# Altium schematic sheet ClockGen.SchDoc: Наименование
size 420 x 297 mm; ApprovedBy: Утвердил; CheckedBy: Проверил; Author: Разработал; CompanyName: Организация; DrawnBy: Н.Контр; Engineer: Т.Контр; SheetNumber: 1; SheetTotal: 1; PageSetup: Record=PageOptions|CenterHorizontal=True|CenterVertical=True|PrintScale=0.94|XCorrection=1.00|YCorrection=1.00|PrintKind=1|BorderSize=5000000|LeftOffset=0|BottomOffset=0|Orientation=1|PaperLength=1000|PaperWidth=1000|Scale=100|PaperSource=7|PrintQuality=-4|MediaType=1|DitherType=10|PaperKind=A4|PrintScaleMode=1; DecimalNumber: ClockGen; HeadOfSector: Нач. сектора; MainDevice: Перв.примен.; Name: Наименование; DocumentName: Sheet1.SCHDOC
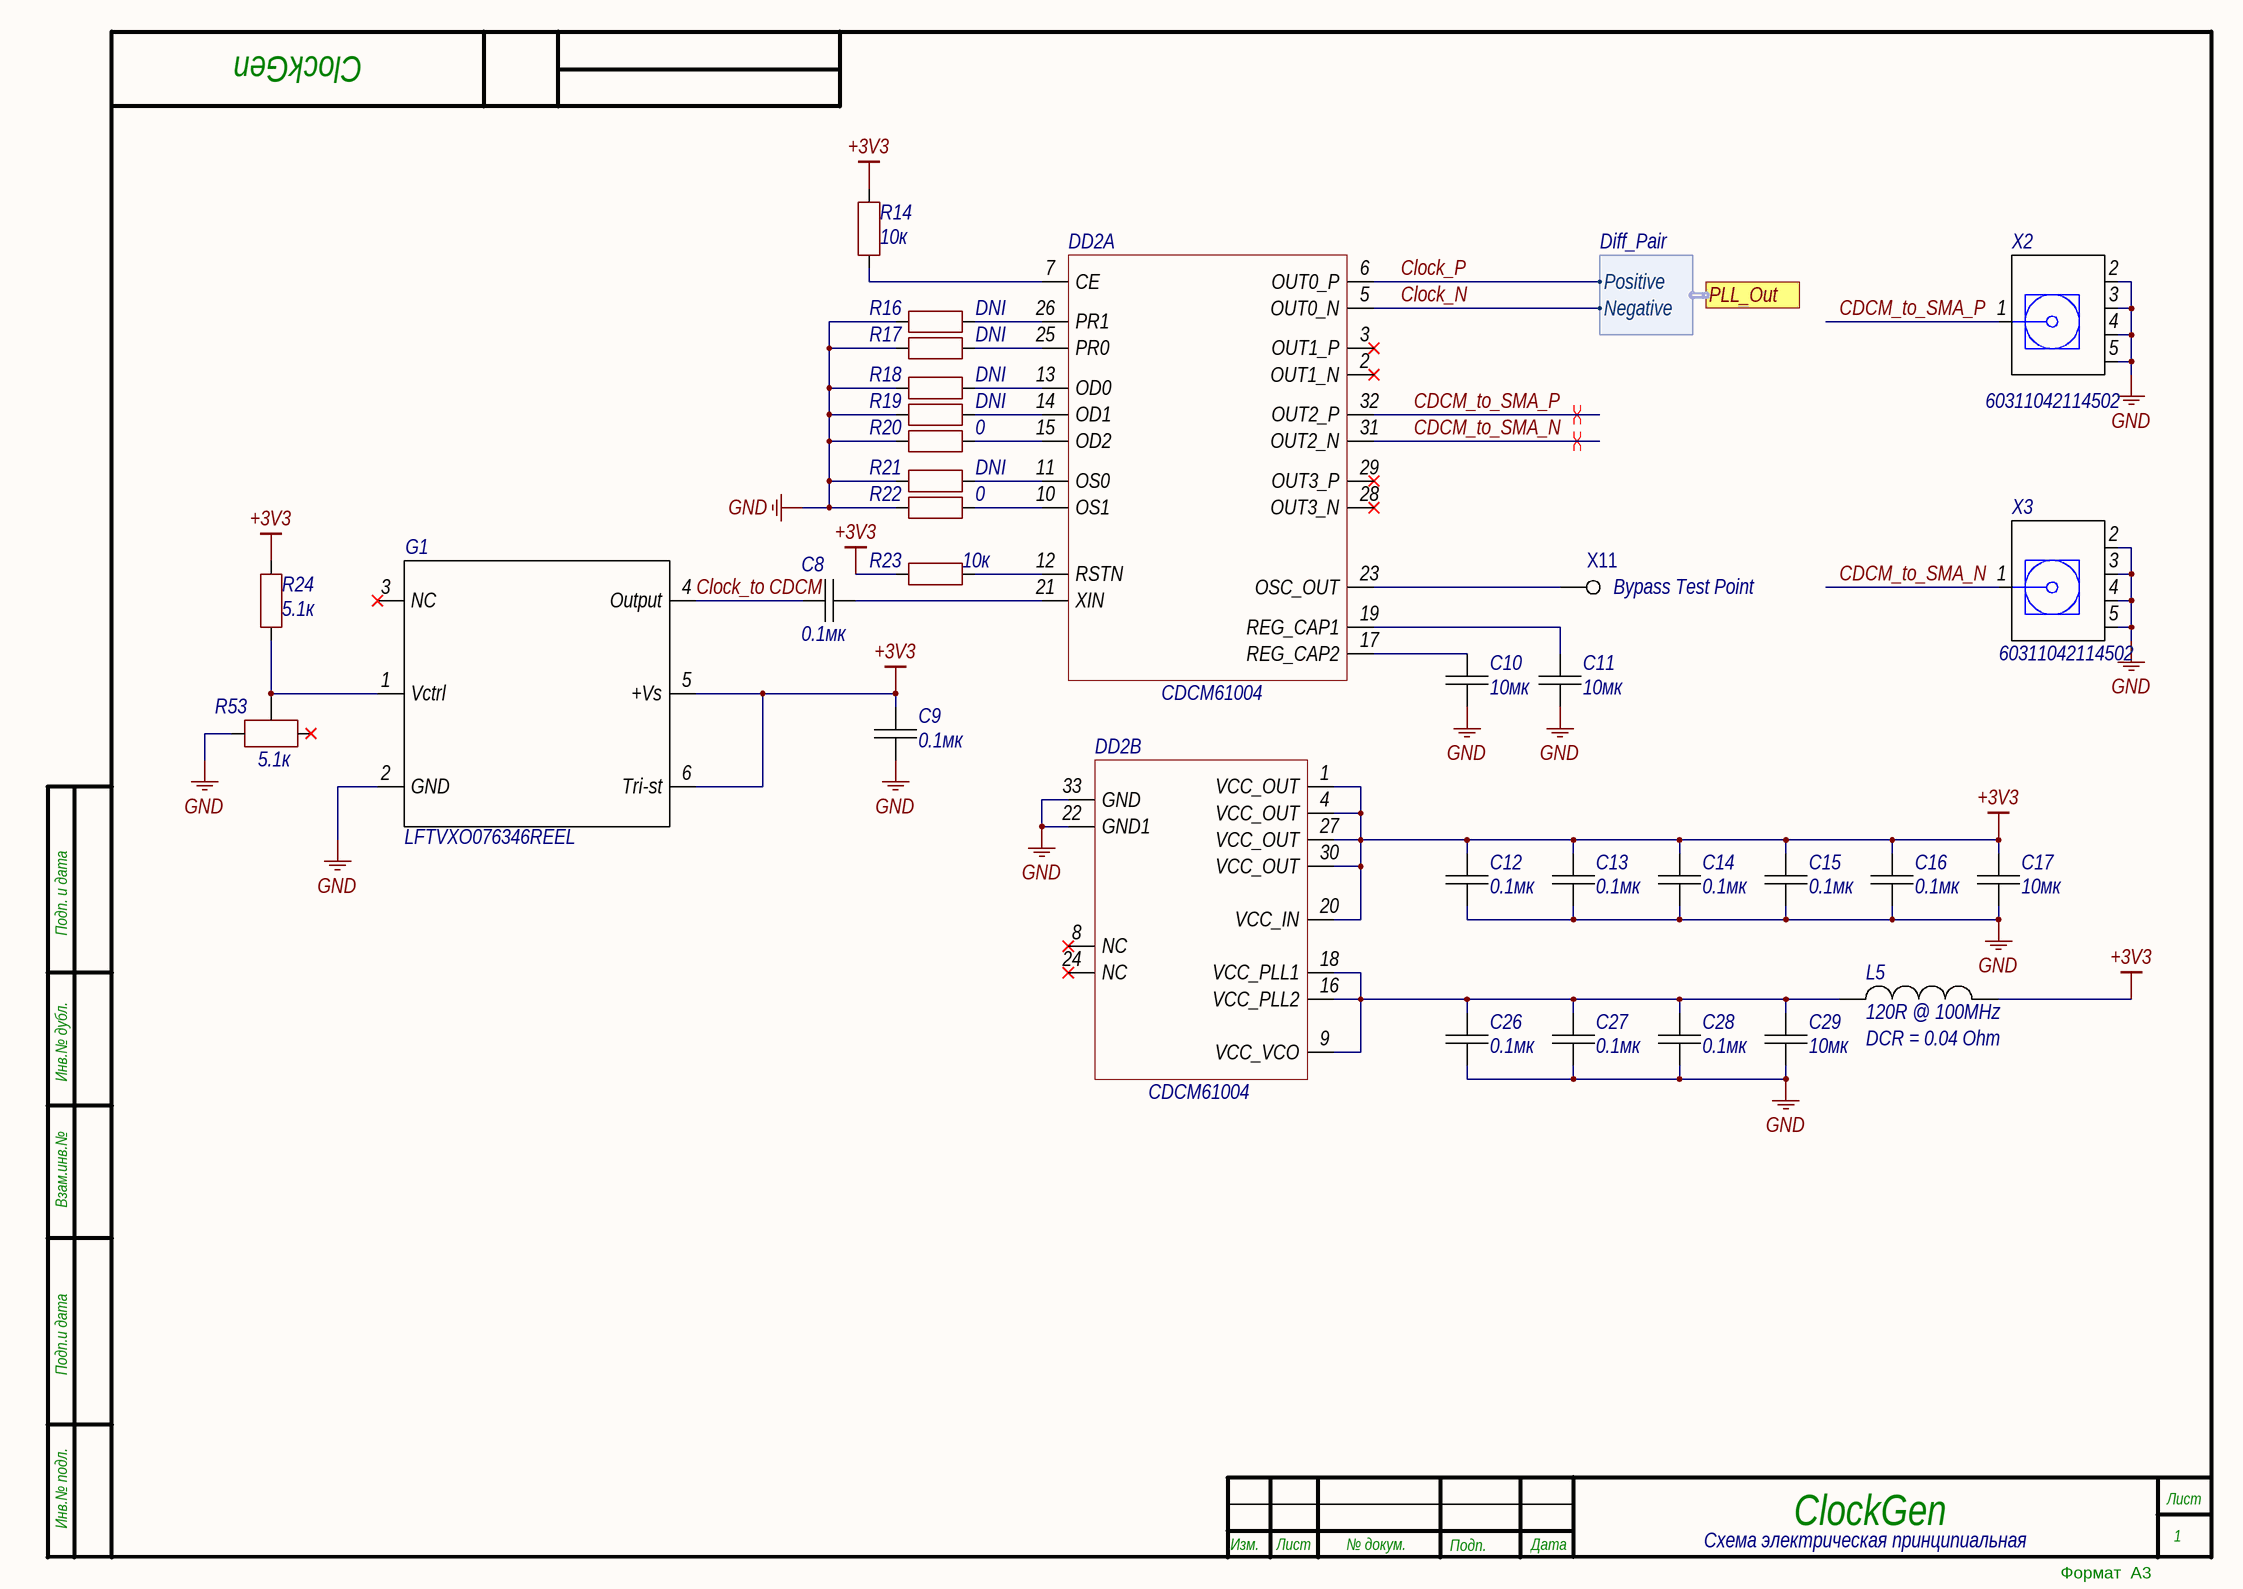
[diagram p0: ClockGen.SchDoc]

## Parts
C8  value 0.1мк  [CAP0402]  (hidden comment: 0.1мк 50V)
C9  value 0.1мк  [CAPC0805N]  (hidden comment: 0.1мк *)
C10  value 10мк  [CAPC0603N]  (hidden comment: 10мк 10V)
C11  value 10мк  [CAPC0603N]  (hidden comment: 10мк 10V)
C12  value 0.1мк  [CAP0402]  (hidden comment: 0.1мк 50V)
C13  value 0.1мк  [CAP0402]  (hidden comment: 0.1мк 50V)
C14  value 0.1мк  [CAP0402]  (hidden comment: 0.1мк 50V)
C15  value 0.1мк  [CAP0402]  (hidden comment: 0.1мк 50V)
C16  value 0.1мк  [CAP0402]  (hidden comment: 0.1мк 50V)
C17  value 10мк  [CAPC0603N]  (hidden comment: 10мк 10V)
C26  value 0.1мк  [CAP0402]  (hidden comment: 0.1мк 50V)
C27  value 0.1мк  [CAP0402]  (hidden comment: 0.1мк 50V)
C28  value 0.1мк  [CAP0402]  (hidden comment: 0.1мк 50V)
C29  value 10мк  [CAPC0603N]  (hidden comment: 10мк 10V)
DD2  CDCM61004  [QFN-32_N_TP]  (parts A,B of 2)
G1  LFTVXO076346REEL  [LFTVXO076346REEL_IQD]
L5  DCR = 0.04 Ohm  value 120R @ 100MHz  [IND-0805_N]
R14  10к  [RESC0402(1005)_M]
R16  DNI  [RESC0402(1005)_M]
R17  DNI  [RESC0402(1005)_M]
R18  DNI  [RESC0402(1005)_M]
R19  DNI  [RESC0402(1005)_M]
R20  0  [RESC0402(1005)_M]
R21  DNI  [RESC0402(1005)_M]
R22  0  [RESC0402(1005)_M]
R23  10к  [RESC0402(1005)_M]
R24  5.1к  [RESC0603N]
R53  value 5.1к  [TRIM_3006P-1-103LF]  (hidden comment: TRIM_3006P-1-103LF)
X2  (no value)  [60311042114502]
X3  (no value)  [60311042114502]
X11  PAD-CONNECT-MINI  [PAD-CONNECT-MINI]  (value not drawn)  (no BOM)

## Ports
PLL_Out (harness Diff_Pair)

## Harnesses
Diff_Pair: Negative, Positive

## Nets
+3V3: C9.2 C12.2 C13.1 C14.1 C15.1 C16.1 C17.2 DD2.1(VCC_OUT) DD2.4(VCC_OUT) DD2.20(VCC_IN) DD2.27(VCC_OUT) DD2.30(VCC_OUT) G1.5(+Vs) G1.6(Tri-st) L5.2 R14.2 R23.2 R24.2
GND: C9.1 C10.1 C11.2 C12.1 C13.2 C14.2 C15.2 C16.2 C17.1 C26.1 C27.2 C28.2 C29.1 DD2.22(GND1) DD2.33(GND) G1.2(GND) R16.1 R17.1 R18.1 R19.1 R20.1 R21.1 R22.1 R53.1 X2.2(GND) X2.3(GND) X2.4(GND) X2.5(GND) X3.2(GND) X3.3(GND) X3.4(GND) X3.5(GND)
CDCM_to_SMA_N: DD2.31(OUT2_N) X3.1(Signal)
CDCM_to_SMA_P: DD2.32(OUT2_P) X2.1(Signal)
Clock_N: DD2.5(OUT0_N) ; port PLL_Out.Negative
Clock_P: DD2.6(OUT0_P) ; port PLL_Out.Positive
Clock_to CDCM: C8.1 G1.4(Output)
NetC8_2: C8.2 DD2.21(XIN)
NetC10_2: C10.2 DD2.17(REG_CAP2)
NetC11_1: C11.1 DD2.19(REG_CAP1)
NetC26_2: C26.2 C27.1 C28.1 C29.2 DD2.9(VCC_VCO) DD2.16(VCC_PLL2) DD2.18(VCC_PLL1) L5.1
NetDD2_7: DD2.7(CE) R14.1
NetDD2_10: DD2.10(OS1) R22.2
NetDD2_11: DD2.11(OS0) R21.2
NetDD2_12: DD2.12(RSTN) R23.1
NetDD2_13: DD2.13(OD0) R18.2
NetDD2_14: DD2.14(OD1) R19.2
NetDD2_15: DD2.15(OD2) R20.2
NetDD2_23: DD2.23(OSC_OUT) X11.1
NetDD2_25: DD2.25(PR0) R17.2
NetDD2_26: DD2.26(PR1) R16.2
NetG1_1: G1.1(Vctrl) R24.1 R53.2

Not connected (* = marked no-connect by the designer): DD2 2(OUT1_N)* 3(OUT1_P)* 8(NC)* 24(NC)* 28(OUT3_N)* 29(OUT3_P)*; G1 3(NC)*; R53 3*

## Layout directives
differential pair; differential pair class LVDS/PECL: CDCM_to_SMA_N, CDCM_to_SMA_P

## Notes on the sheet
- (near X11) Bypass Test Point
- Схема электрическая принципиальная
- Подп. и дата
- Инв.№ дубл.
- Взам.инв.№
- Подп.и дата
- Инв.№ подл.
- Изм.
- Лист
- № докум.
- Подп.
- Дата
- Формат  A3

## Library data of the parts
C8 C12-C16 C26-C28 = CAP0402: Manufacturer: Samsung Electro-Mechanics; ManufacturerAlt: JLCPCB; MPN: CL05B104KB54PNC; MPNAlt: C307331; MntType: SMD; Notes: Basic Part; Tolerance: 10%; Height: 0.5mm; MSL: MSL 1; Package: =Footprint; RoHS: Comply; Weight: 1.500mg; PartType: CHIP CERAMIC CAPACITOR; Pins: 2; BOMDescription: =MntType+' '+PartType+' '+Package+' '+Value+' '+Tolerance+' '+Voltage+' '+TempCoeff+' '+MPN; CFootprint: =Footprint; Voltage: 50V; Part Number: CAP0402; ClassName: Capacitor; ComponentLink1Description: Datasheet; ComponentLink1Description: New link; ComponentLink1URL: https://datasheet.lcsc.com/lcsc/1810191222_Samsung-Electro-Mechanics-CL05B104KB54PNC_C307331.pdf
C9 = CAPC: MntType: SMD; MSL: MSL 1; Package: =Footprint; RoHS: Comply; PartType: CHIP CERAMIC CAPACITOR; Pins: 2; BOMDescription: =MntType+' '+PartType+' '+Package+' '+Value+' '+Tolerance+' '+Voltage+' '+TempCoeff+' '+MPN; CFootprint: =Footprint; Voltage: *; PART NUMBER: CAPC; CLASSNAME: Capacitor; COMPONENTLINK1DESCRIPTION: Datasheet
C10 C11 C17 C29 = CAPC: Manufacturer: Samsung Electro-Mechanics; ManufacturerAlt: JLCPCB; MPN: CL10A106KP8NNNC; MPNAlt: C19702; MntType: SMD; Tolerance: 10%; MSL: MSL 1; Package: =Footprint; RoHS: Comply; PartType: CHIP CERAMIC CAPACITOR; Pins: 2; BOMDescription: =MntType+' '+PartType+' '+Package+' '+Value+' '+Tolerance+' '+Voltage+' '+TempCoeff+' '+MPN; CFootprint: =Footprint; Voltage: 10V; Part Number: CAPC; ClassName: Capacitor; ComponentLink1Description: Datasheet; ComponentLink1Description: New link; ComponentLink1URL: https://datasheet.lcsc.com/lcsc/1810191219_Samsung-Electro-Mechanics-CL10A106KP8NNNC_C19702.pdf
DD2 = CDCM61004: MANUFACTURER: Texas Instruments; MNTTYPE: SMD; PART NUMBER: CDCM61004; MPN: CDCM61004; MSL: MSL 1; PACKAGE: VQFN32; ROHS: Comply; PARTTYPE: PLL; PINS: 32; BOMDESCRIPTION: =MntType+' '+PartType+' '+Package+' '+Value+' '+Tolerance+' '+Voltage+' '+TempCoeff+' '+MPN; CFOOTPRINT: =Footprint; CLASSNAME: PLL; COMPONENTLINK1DESCRIPTION: Datasheet; COMPONENTLINK1URL: https://www.ti.com/lit/ds/symlink/cdcm61004.pdf
G1 = LFTVXO076346REEL: MANUFACTURER: IQD; MNTTYPE: SMD; ComponentLink1Description: Datasheet; MPN: LFTVXO076346REEL; PART NUMBER: LFTVXO076346REEL; MSL: SML 1; PACKAGE: =Footprint; ROHS: Comply; PARTTYPE: VCTCXO; PINS: 6; BOMDESCRIPTION: =MntType+' '+PartType+' '+Package+' '+Value+' '+Tolerance+' '+Voltage+' '+TempCoeff+' '+MPN; CFOOTPRINT: =Footprint; COMPONENTLINK1URL: https://nl.mouser.com/datasheet/2/741/LFTVXO076346Reel-1148098.pdf
L5 = PBY201209T-121Y-N: Manufacturer: Chilisin Elec; ManufacturerAlt: JLCPCB; MPNAlt: C142063; MntType: SMD; BOMDescription: SMD INDUCTOR 0805 120R @ 100MHz    PBY201209T-121Y-N; MPN: PBY201209T-121Y-N; MSL: MSL 1; Package: 0805; RoHS: Comply; PartType: INDUCTOR; Pins: 2; CFootprint: =Footprint; Part Number: PBY201209T-121Y-N; ClassName: Inductor; ComponentLink1Description: Datasheet; ComponentLink1URL: https://datasheet.lcsc.com/lcsc/1810261221_Chilisin-Elec-PBY201209T-121Y-N_C142063.pdf
R14 R23 = RES0402: Manufacturer: UNI-ROYAL(Uniroyal Elec); ManufacturerAlt: JLCPCB; MPN: 0402WGF1002TCE; MPNAlt: C25744; MntType: SMD; MSL: MSL 1; Package: =Footprint; RoHS: Comply; PartType: CHIP RESISTOR; Pins: 2; BOMDescription: =MntType+' '+PartType+' '+Package+' '+Value+' '+Tolerance+' '+Voltage+' '+TempCoeff+' '+MPN; CFootprint: =Footprint; Value: 10к; Part Number: RES0402; ClassName: Resistor; ComponentLink1Description: Datasheet
R16-R22 = RES0402: Manufacturer: UNI-ROYAL(Uniroyal Elec); ManufacturerAlt: JLCPCB; MPN: 0402WGF0000TCE; MPNAlt: C17168; MntType: SMD; MSL: MSL 1; Package: =Footprint; RoHS: Comply; PartType: CHIP RESISTOR; Pins: 2; BOMDescription: =MntType+' '+PartType+' '+Package+' '+Value+' '+Tolerance+' '+Voltage+' '+TempCoeff+' '+MPN; CFootprint: =Footprint; Part Number: RES0402; ClassName: Resistor; ComponentLink1Description: Datasheet; ComponentLink1Description: New link; ComponentLink1URL: https://datasheet.lcsc.com/lcsc/2110251730_UNI-ROYAL-Uniroyal-Elec-0402WGF0000TCE_C17168.pdf
  R16-R19 R21: Value: DNI
  R20 R22: Value: 0
R24 = RES: MntType: SMD; MSL: MSL 1; Package: =Footprint; RoHS: Comply; PartType: CHIP RESISTOR; Pins: 2; BOMDescription: =MntType+' '+PartType+' '+Package+' '+Value+' '+Tolerance+' '+Voltage+' '+TempCoeff+' '+MPN; CFootprint: =Footprint; Value: 5.1к; PART NUMBER: RES; CLASSNAME: Resistor; COMPONENTLINK1DESCRIPTION: Datasheet
R53 = TRIM_3006P-1-103LF: MANUFACTURER: Bourns; MNTTYPE: TH; ComponentLink1Description: Datasheet; PART NUMBER: TRIM_3006P-1-103LF; MPN: TRIM_3006P-1-103LF; MSL: MSL 1; PACKAGE: = Footprint; ROHS: Comply; PARTTYPE: RES; PINS: 3; BOMDESCRIPTION: =MntType+' '+PartType+' '+Package+' '+Value+' '+Tolerance+' '+Voltage+' '+TempCoeff+' '+MPN; CFOOTPRINT: =Footprint; COMPONENTLINK1URL: https://static.chipdip.ru/lib/948/DOC011948535.pdf
X2 X3 = SMA_WR_60311042114502: MANUFACTURER: WE; MNTTYPE: SMD; PART NUMBER: SMA_WR_60311042114502; MPN: 60311042114502; MSL: MSL 1; ROHS: Comply; PARTTYPE: SMA; PINS: 5; BOMDESCRIPTION: =MntType+' '+PartType+' '+Package+' '+Value+' '+Tolerance+' '+Voltage+' '+TempCoeff+' '+MPN; CFOOTPRINT: =Footprint; CLASSNAME: SMA; COMPONENTLINK1DESCRIPTION: Datasheet; COMPONENTLINK1URL: https://katalog.we-online.de/em/datasheet/60311042114502.pdf
X11 = PAD-CONNECT-MINI: MntType: SMD; MSL: MSL 1; RoHS: Comply; BOMDescription: SMD; CFootprint: =Footprint; PART NUMBER: PAD-CONNECT-MINI; CLASSNAME: Test_Point; COMPONENTLINK1DESCRIPTION: Datasheet